# Altium schematic sheet Power.SchDoc
size A4
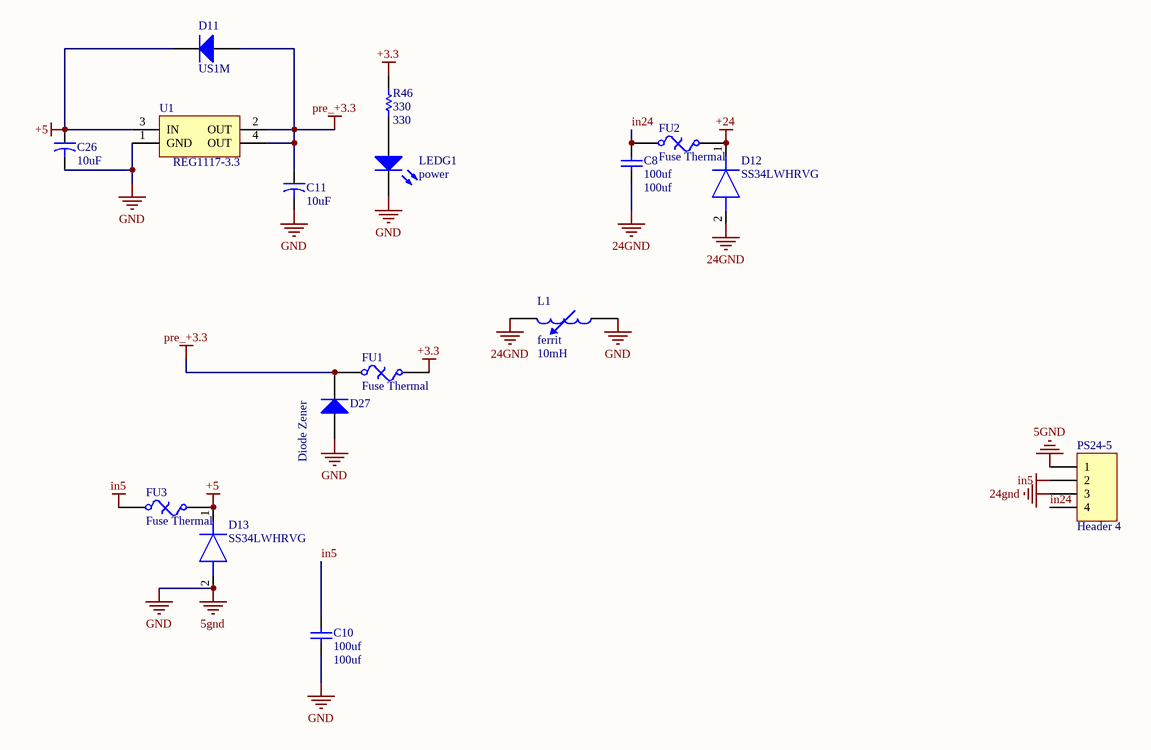
[diagram p0: Power.SchDoc]

## Parts
C8  100uf  [HDR1X2]
C10  100uf  [HDR1X2]
C11  10uF  [0805]
C26  10uF  [0805]
D11  US1M  [US1M]
D12  SS34LWHRVG  [SS34]
D13  SS34LWHRVG  [SS34]
D27  Diode Zener  [d1805]
FU1  Fuse Thermal  [1206]
FU2  Fuse Thermal  [resetable fuse 3A]
FU3  Fuse Thermal  [1206]
L1  ferrit  value 10mH  [fBEAD]
LEDG1  power  [3518]
PS24-5  Header 4  [phoenix4-right]
R46  330  [0805]
U1  REG1117-3.3  [SOT223]

## Nets
5GND: C10.1 C11.2 C26.2 D13.2(A) D27.1(A) L1.1 LEDG1.2(K) PS24-5.1 U1.1(GND)  [also labelled GND]
24GND: C8.1 D12.2(A) L1.2 PS24-5.3
+3.3: FU1.2 R46.1
+5: C26.1 D11.2(K) D13.1(K) FU3.2 U1.3(IN)
+24: D12.1(K) FU2.2
in5: C10.2 FU3.1 PS24-5.2
pre_+3.3: C11.1 D11.1(A) D27.2(K) FU1.1 U1.2(OUT) U1.4(OUT)
in24: C8.2 FU2.1 PS24-5.4
NetLEDG1_1: LEDG1.1(A) R46.2

## Library data of the parts
C8 C10 = Cap: Capacitor; Published: 8-Jun-2000; LatestRevisionDate: 17-Jul-2002; LatestRevisionNote: Re-released for DXP Platform.; PackageReference: RAD-0.3; Publisher: Altium Limited; PackageDescription: Radial Cap, Thru-Hole; 2 Leads; 0.3 in Pin Spacing; Value: 100uf
C11 C26 = Cap_El: Capacitor; Published: 23-Sep-2002; PackageReference: CAPR5-4X5; Publisher: Altium Limited; Value: 10uF
D11 = Diode: 1 Amp General Purpose Rectifier; Revision 1: 11-Jul-2000: SIM Model Added.; Revision 2: 17-Jul-2002: Re-released for DXP Platform.; Package Information: Latest Revision: Aug-1999; Code - JEDEC: DO-204-AL; Published: 8-Jun-2000; Datasheet: Latest Revision: 1998; Package Reference: DO-41; Publisher: Altium Limited
D12 D13 = SS34LWHRVG: Diode; Manufacturer_Name: Taiwan Semiconductor; Datasheet Link: https://datasheet.datasheetarchive.com/originals/distributors/DKDS-20/389381.pdf; Height: 1.02mm; Manufacturer_Part_Number: SS34LWHRVG; Mouser Part Number: 821-SS34LWHRVG; Mouser Price/Stock: https://www.mouser.co.uk/ProductDetail/Taiwan-Semiconductor/SS34LWHRVG?qs=5aG0NVq1C4zYvYQjFNyRbA%3D%3D; Arrow Part Number: SS34LWHRVG; Arrow Price/Stock: https://www.arrow.com/en/products/ss34lwhrvg/taiwan-semiconductor?region=asia
D27 = Diode 1N914: High Conductance Fast Diode; Published: 8-Jun-2000; LatestRevisionDate: 17-Jul-2002; LatestRevisionNote: Re-released for DXP Platform.; DatasheetVersion: 1997; PackageReference: DO-35; Publisher: Altium Limited; PackageDescription: Diode, Axial; Body 3.8 x 1.9 mm (LxDia. max), Lead Dia. 0.53 mm (max); Code_JEDEC: DO-204-AH; ComponentLink1Description: Manufacturer Link; ComponentLink1URL: http://www.fairchildsemi.com/; ComponentLink2Description: Datasheet; ComponentLink2URL: http://www.fairchildsemi.com/ds/1N%2F1N4448.pdf
FU1-FU3 = Fuse Thermal: Thermal Fuse; Published: 24-Mar-1999; LatestRevisionDate: 17-Jul-2002; LatestRevisionNote: Re-released for DXP Platform.; PackageReference: PIN-W2/E2.8; Publisher: Altium Limited; PackageDescription: Thru-Hole; 2 Leads
L1 = Inductor Adj: Adjustable Inductor; Set Position: 0.5; Published: 24-Mar-1999; LatestRevisionDate: 17-Jul-2002; LatestRevisionNote: Re-released for DXP Platform.; PackageReference: AXIAL-0.8; Publisher: Altium Limited; PackageDescription: Axial Device, Thru-Hole; 2 Leads; 0.8 in Pin Spacing
LEDG1 = LED3: Typical BLUE SiC LED; pin to pad: 1>2 2>1; Published: 8-Jun-2000; LatestRevisionDate: 17-Dec-2003; LatestRevisionNote: PCB Footprint replaced.; DatasheetDocument: 16-Apr-2002; PackageDocument: 16-Apr-2002; PackageReference: 3.5X2.8X1.9; Publisher: Altium Limited
PS24-5 = Header 4: Header, 4-Pin; LatestRevisionDate: 17-Jul-2002; LatestRevisionNote: Re-released for DXP Platform.; Publisher: Altium Limited
R46 = Res1: Resistor; Published: 8-Jun-2000; LatestRevisionDate: 17-Jul-2002; LatestRevisionNote: Re-released for DXP Platform.; PackageReference: AXIAL-0.3; Publisher: Altium Limited; Value: 330
U1 = REG1117-3.3: 800mA and 1A Low Dropout Positive Regulator 2.85V, 3.3V, 5V, and Adjustable; Published: 8-Jun-2000; LatestRevisionDate: 17-Jul-2002; LatestRevisionNote: Re-released for DXP Platform.; DatasheetVersion: Sep-1997; PackageVersion: revC; PackageReference: ZZ311; Publisher: Altium Limited; PackageDescription: SOT-223/SC-73; 4 Leads; Body 6.7 x 7.3 mm, inc. leads (LxW max); ComponentLink1Description: Manufacturer Link; ComponentLink1URL: http://www.ti.com/; ComponentLink2Description: Datasheet; ComponentLink2URL: http://www-s.ti.com/sc/ds/REG1117.pdf